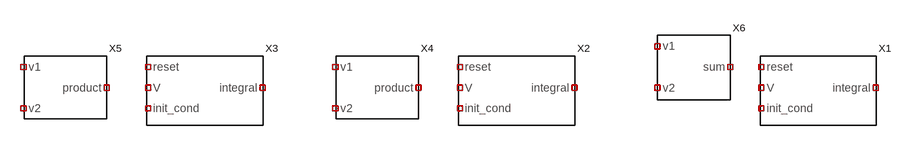
[diagram p0: schematic Lorenz.asc]
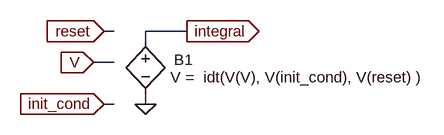
[diagram p1: sub-circuit integrator_module.asc]
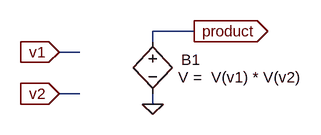
[diagram p2: sub-circuit multiplier_module.asc]
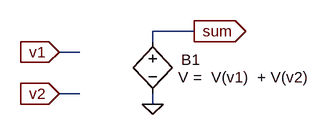
[diagram p3: sub-circuit sum_module.asc]
Lorenz.asc, the LTspice schematic file:
Version 4
SHEET 1 880 680
SYMBOL integrator_module 624 -96 R0
SYMATTR InstName X1
SYMBOL integrator_module 160 -96 R0
SYMATTR InstName X2
SYMBOL integrator_module -320 -96 R0
SYMATTR InstName X3
SYMBOL multiplier_module -80 -96 R0
SYMATTR InstName X4
SYMBOL multiplier_module -560 -96 R0
SYMATTR InstName X5
SYMBOL sum_module 400 -128 R0
SYMATTR InstName X6

integrator_module.asc, the sub-circuit schematic file:
Version 4
SHEET 1 880 680
WIRE 128 160 112 160
WIRE 240 160 176 160
WIRE 176 176 176 160
WIRE 128 208 96 208
WIRE 128 272 112 272
WIRE 176 272 176 256
FLAG 96 208 V
IOPIN 96 208 In
FLAG 176 272 0
FLAG 240 160 integral
IOPIN 240 160 Out
FLAG 112 272 init_cond
IOPIN 112 272 In
FLAG 112 160 reset
IOPIN 112 160 In
SYMBOL bv 176 160 R0
WINDOW 0 44 44 Left 0
WINDOW 3 39 71 Left 0
SYMATTR InstName B1
SYMATTR Value V =  idt(V(V), V(init_cond), V(reset) )

multiplier_module.asc, the sub-circuit schematic file:
Version 4
SHEET 1 880 680
WIRE 240 160 176 160
WIRE 176 176 176 160
WIRE 64 192 32 192
WIRE 64 256 32 256
WIRE 176 272 176 256
FLAG 32 192 v1
IOPIN 32 192 In
FLAG 32 256 v2
IOPIN 32 256 In
FLAG 176 272 0
FLAG 240 160 product
IOPIN 240 160 Out
SYMBOL bv 176 160 R0
WINDOW 0 44 44 Left 0
WINDOW 3 39 71 Left 0
SYMATTR InstName B1
SYMATTR Value V =  V(v1) * V(v2)

sum_module.asc, the sub-circuit schematic file:
Version 4
SHEET 1 880 680
WIRE 240 160 176 160
WIRE 176 176 176 160
WIRE 64 192 32 192
WIRE 64 256 32 256
WIRE 176 272 176 256
FLAG 32 192 v1
IOPIN 32 192 In
FLAG 32 256 v2
IOPIN 32 256 In
FLAG 176 272 0
FLAG 240 160 sum
IOPIN 240 160 Out
SYMBOL bv 176 160 R0
WINDOW 0 44 44 Left 0
WINDOW 3 39 71 Left 0
SYMATTR InstName B1
SYMATTR Value V =  V(v1)  + V(v2)

The netlist it stands for:
* Lorenz.asc
XX1 NC_01 NC_02 NC_03 NC_04 integrator_module
XX2 NC_05 NC_06 NC_07 NC_08 integrator_module
XX3 NC_09 NC_10 NC_11 NC_12 integrator_module
XX4 NC_13 NC_14 NC_15 multiplier_module
XX5 NC_16 NC_17 NC_18 multiplier_module
XX6 NC_19 NC_20 NC_21 sum_module

* block symbol definitions
.subckt integrator_module integral V init_cond reset
B1 integral 0 V =  idt(V(V), V(init_cond), V(reset) )
.ends integrator_module

.subckt multiplier_module product v1 v2
B1 product 0 V =  V(v1) * V(v2)
.ends multiplier_module

.subckt sum_module sum v1 v2
B1 sum 0 V =  V(v1)  + V(v2)
.ends sum_module

.backanno
.end